# EAGLE design Snowman (EAGLE 6.5.0)
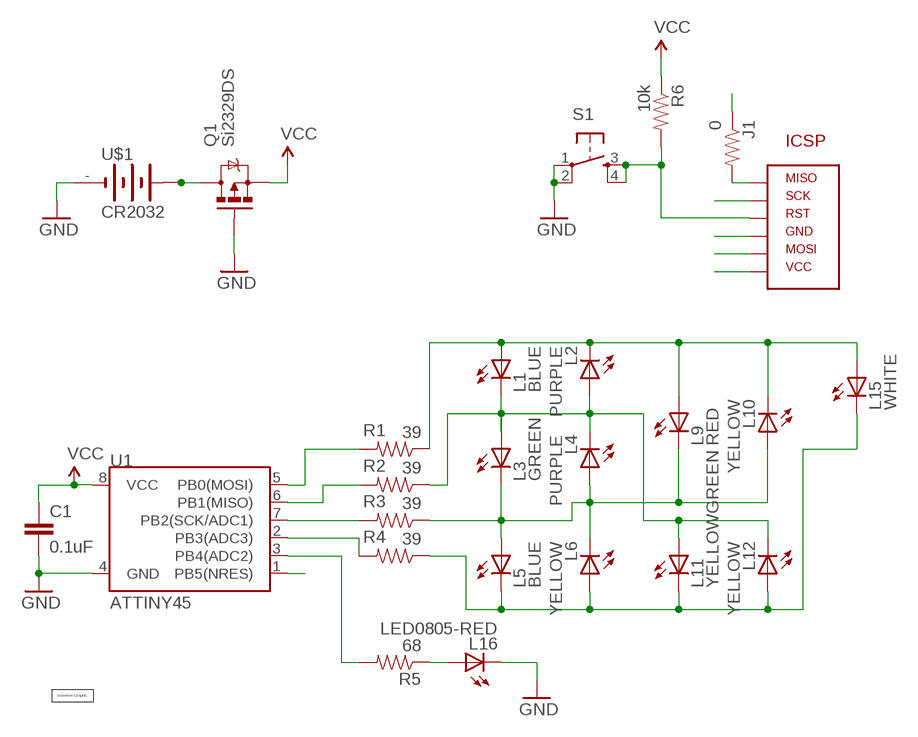
[diagram p0: schematic, sheet 1]

## Parts
C1  0.1uF  CAP0805  [0805]
J1  0  RESISTOR0805-RES  [0805]
L1  BLUE  LED0805-RED  [LED-0805-RED]
L2  PURPLE  LED0805-GREEN  [LED-0805-GREEN]
L3  GREEN  LED0805-RED  [LED-0805-RED]
L4  PURPLE  LED0805-GREEN  [LED-0805-GREEN]
L5  BLUE  LED0805-RED  [LED-0805-RED]
L6  YELLOW  LED0805-GREEN  [LED-0805-GREEN]
L9  RED  LED0805-RED  [LED-0805-RED]
L10  YELLOW  LED0805-GREEN  [LED-0805-GREEN]
L11  YELLOWGREEN  LED0805-GREEN  [LED-0805-GREEN]
L12  YELLOW  LED0805-RED  [LED-0805-RED]
L15  WHITE  LED0805-RED  [LED-0805-RED]
L16  LED0805-RED  [LED-0805-RED]
Q1  Si2329DS  MOSFET_P_CH  [SOT23-3]
R1  39  RESISTOR0805-RES  [0805]
R2  39  RESISTOR0805-RES  [0805]
R3  39  RESISTOR0805-RES  [0805]
R4  39  RESISTOR0805-RES  [0805]
R5  68  RESISTOR0805-RES  [0805]
R6  10k  RESISTOR0805-RES  [0805]
S1  TAC_SWITCHSMD  [TACTILE_SWITCH_SMD]
U1  ATTINY45  [SO08-EIAJ]
U$1  CR2032  BAT-HLD-001  [BAT-HLD-001]
U$2  5X6_SNOWMAN5X5  [5X5_SNOWMAN]
U$3  AVR_ICSP_6P6PIN  [AVR_ICSP_6P_SMD]

## Nets
GND: C1.2 L16.C Q1.1(G) S1.1 S1.2 U1.4(GND) U$1.- U$3.GND
L12: L1.C L2.A L3.A L4.C L11.A L12.C R2.1
MISO: J1.1 R2.2 U1.6(PB1(MISO))
MOSI: R1.2 U1.5(PB0(MOSI)) U$3.MOSI
N$1: Q1.3(D) U$1.+@1(+) U$1.+@2(+)
N$2: R5.2 U1.3(PB4(ADC2))
N$3: L3.C L4.A L5.A L6.C L9.C L10.A R3.1
N$4: R4.2 U1.2(PB3(ADC3))
N$5: L5.C L6.A L11.C L12.A L15.C R4.1
N$6: L1.A L2.C L9.A L10.C L15.A R1.1
N$7: L16.A R5.1
N$8: J1.2 U$3.MISO
RST: R6.2 S1.3 S1.4 U1.1(PB5(NRES)) U$3.RST
SCK: R3.2 U1.7(PB2(SCK/ADC1)) U$3.SCK
VCC: C1.1 Q1.2(S) R6.1 U1.8(VCC) U$3.VCC

## Notes on the sheet
- ICSP

## Library data of the parts
C1 = SparkFun-Capacitors:CAP: Capacitor Standard 0603 ceramic capacitor, and 0.1" leaded capacitor.
J1 = SparkFun-Passives:RESISTOR: Resistor Basic schematic elements and footprints for 0603, 1206, and PTH resistors.
L1-L6 L9-L12 L15 L16 = My Custom Parts:LED
Q1 = My Custom Parts:MOSFET_P_CH
R1-R6 = SparkFun-Resistors:RESISTOR: Resistor Basic schematic elements and footprints for 0603, 1206, and PTH resistors.
S1 = My Custom Parts:TAC_SWITCH: Momentary Switch Button commonly used for reset or general input. Spark Fun Electronics SKU : COM-00097 SMT- SWCH-08247; PROD_ID: SWCH-08247
U1 = SparkFun:ATTINY45: Atmel ATTiny45
U$1 = My Custom Parts:BAT-HLD-001
U$2 = BMPs:5X6_SNOWMAN: 5cm X 6cm Snowman Graphic
U$3 = My Custom Parts:AVR_ICSP_6P

## Board
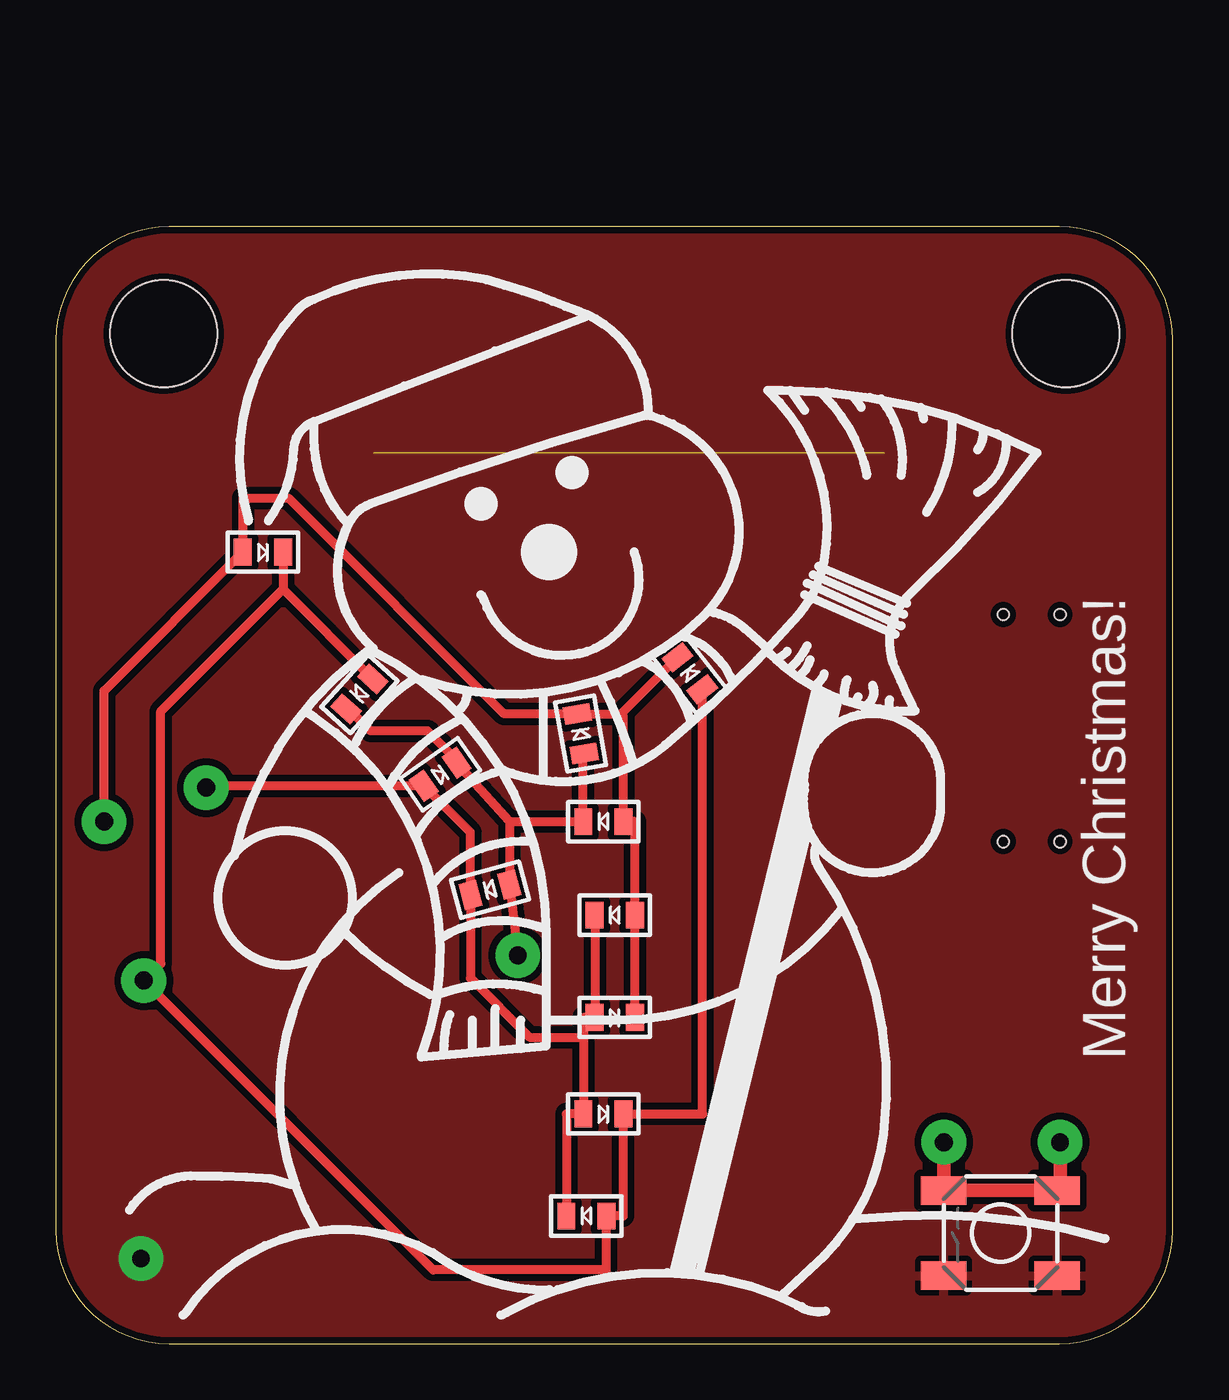
[diagram p1: board, top side]
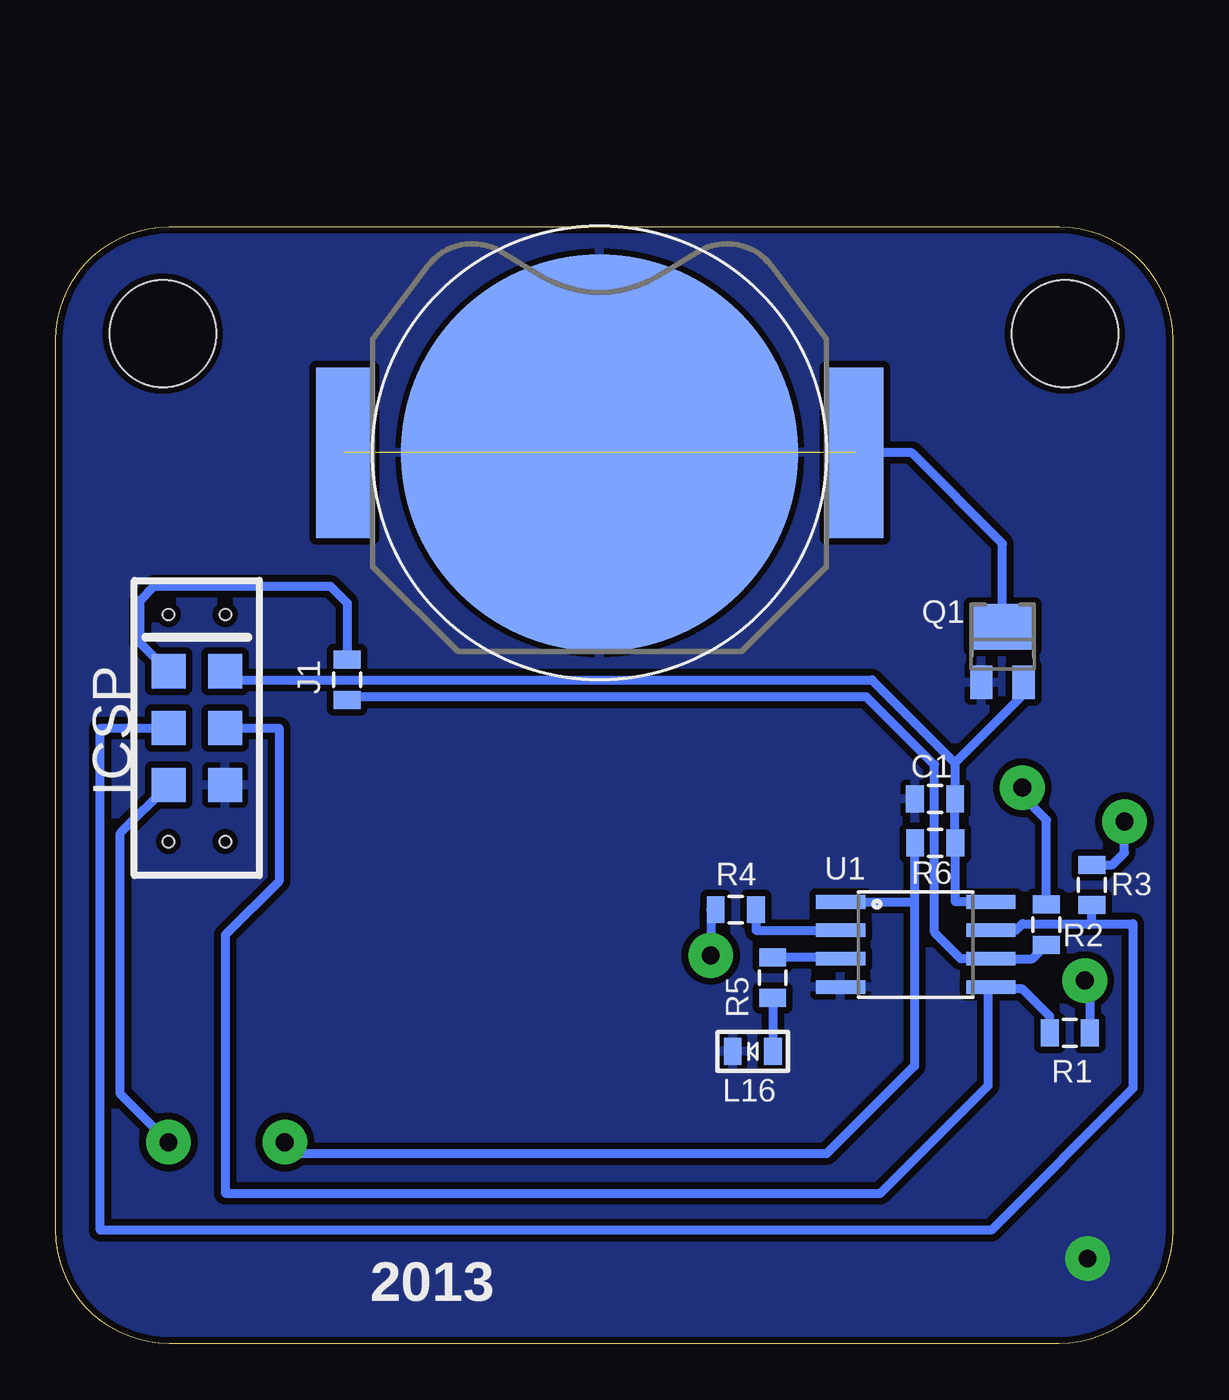
[diagram p2: board, bottom side, seen from below]

Size 50 x 50 mm. Coordinates in mm from the lower left corner, seen from the top.
Outline: 0,44.92 0,5.08 arc90 5.08,0 44.92,0 arc90 50,5.08 50,44.92 arc90 44.92,50 5.08,50 arc90 0,44.92
Copper layers (1*16): Top 0.035mm / dielectric 1.5mm / Bottom 0.035mm
Design rules "tim": minimum track width 10mil, minimum drill 32mil, track to track 12mil, track to pad 12mil, pad to pad 12mil, via to via 12mil, smd to smd 8mil, copper to edge 12mil, drill to drill 12mil, minimum pad ring 0.6mm, minimum via ring 0.6mm, stop-mask expansion 0mil, vias tented up to drill 0mil, thermal gap 10mil
Holes 4.76 mm at 4.83,45.21 45.21,45.21

### Footprints (pad centres in the part's own frame; a part is rotated, then mirrored left to right if it is on the bottom)
0805 = smd 0.8 x 1.2: 1 -0.9,0; 2 0.9,0
LED-0805-RED = smd 0.8 x 1.2: A -0.9,0; C 0.9,0
LED-0805-GREEN = smd 0.8 x 1.2: A -0.9,0; C 0.9,0
SOT23-3 = smd 1 x 1.5: 1 -0.95,-1.254; 2 0.95,-1.254 | smd 2.9 x 2.05: 3 0,1.227
TACTILE_SWITCH_SMD = smd 2.032 x 1.27: 1 -2.54,1.905; 2 2.54,1.905; 3 -2.54,-1.905; 4 2.54,-1.905
SO08-EIAJ = smd 0.61 x 2.21: 1 -1.905,-3.378; 2 -0.635,-3.378; 3 0.635,-3.378; 4 1.905,-3.378; 5 1.905,3.353; 6 0.635,3.353; 7 -0.635,3.353; 8 -1.905,3.353
BAT-HLD-001 = smd 2.54 x 7.62: +@1 -11.43,0; +@2 11.43,0 | smd 17.78 x 17.78: - 0,0
AVR_ICSP_6P_SMD = smd 1.524 x 1.524: GND 0,0; MISO 5.08,2.54; MOSI 2.54,0; RST 0,2.54; SCK 2.54,2.54; VCC 5.08,0 | hole 0.5: -2.54,2.54; 7.62,2.54; -2.54,0; 7.62,0

### Placement (x,y rotation side)
C1  10.64,24.38 180 bottom
J1  36.96,29.72 90 bottom
L1  23.75,5.71 180 top
L2  24.51,10.29 0 top
L3  25.02,14.61 0 top
L4  25.02,19.18 180 top
L5  24.51,23.37 180 top
L6  23.5,27.3 100 top
L9  28.38,30.01 128 top
L10  9.27,35.43 0 top
L11  17.21,25.49 35 top
L12  19.43,20.32 195 top
L15  13.59,29.08 228 top
L16  18.8,13.08 180 bottom
Q1  7.62,30.86 0 bottom
R1  4.61,13.91 180 bottom
R2  5.65,18.76 270 bottom
R3  3.62,20.54 270 bottom
R4  19.56,19.43 0 bottom
R5  17.91,16.38 90 bottom
R6  10.63,22.42 180 bottom
S1  42.29,4.95 180 top
U1  11.5,17.87 270 bottom
U$1  25.65,39.88 180 bottom
U$2  -0.08,-0.7 0 top
U$3  42.42,25.02 90 bottom

### Tracks (layer width: path | path; a pad name or v marks a point on that pad's centre or on a via)
GND  (via drill 0.8)
  other vias: 3.81,3.81
  pour Top (isolate 0.305): -1.14,50.93 -1.14,-1.14 52.32,-1.14 52.32,50.93
  pour Bottom (isolate 0.305): -1.91,51.69 52.07,51.56 51.82,-1.14 -2.16,-1.02
L12  (via drill 0.8)
  Top 0.406: 23.62,13.72 23.62,14.61 L3.A L4.C | 23.62,13.72 23.62,10.29 L2.A 22.86,10.29 L1.C | 23.62,13.72 21.21,13.72 18.56,16.36 L12.C 18.56,22.89 L11.A 6.81,24.97 v6.73,24.89
  Bottom 0.406: v6.73,24.89 6.73,24.51 5.65,23.43 R2.1
MISO
  Bottom 0.406: 5.71,17.8 R2.2 6.28,17.23 U1.6 9.49,17.23 10.67,18.41 10.67,25.91 13.72,28.96 36.82,28.96 J1.1
MOSI
  Bottom 0.406: U$3.MOSI 40.01,27.56 40.01,20.7 42.42,18.29 42.42,6.73 13.08,6.73 8.26,11.56 8.26,15.85 U1.5 8.05,15.88 6.73,15.88 5.51,14.65 R1.2
N$1  (1 unrouted)
  Bottom 0.406: U$1.+@1 11.68,39.88 7.62,35.81 Q1.3
N$2
  Bottom 0.406: U1.3 14.87,17.28 R5.2
N$3  (via drill 0.8)
  Top 0.406: L3.C L4.A 25.92,23.37 L5.A 25.41,28.08 25.3,28.19 | 25.3,28.19 L6.C 20.07,28.19 10.41,37.85 8.38,37.85 8.38,35.43 L10.A 2.16,29.22 v2.16,23.37 | 25.3,28.19 L9.C
  Bottom 0.406: R3.1 2.69,21.44 2.16,21.97 v2.16,23.37
N$4
  Bottom 0.406: U1.2 18.66,18.5 R4.2
N$5  (via drill 0.8)
  Top 0.305: 23.61,26.16 L6.A
  Top 0.406: 20.3,23.37 L5.C 23.61,26.16 | 20.3,23.37 L12.A v20.68,17.38 | L15.C 13.12,28.41 14.1,27.43 16.64,27.43 17.95,26.12 L11.C 20.3,23.37
  Bottom 0.406: R4.1 20.68,19.43 v20.68,17.38
N$6  (via drill 0.8)
  Top 0.406: L9.A 28.96,29.28 28.96,10.29 L2.C 25.4,5.71 L1.A 24.64,5.71 24.64,3.3 16.89,3.3 v3.94,16.26 4.7,17.02 4.7,28.3 10.17,33.77 | L10.C 10.17,33.77 | 10.17,33.77 L15.A
  Bottom 0.406: v3.94,16.26 3.71,16.03 R1.1
N$7
  Bottom 0.406: R5.1 L16.A
N$8
  Bottom 0.406: J1.2 36.96,33.15 37.72,33.91 45.59,33.91 46.23,33.27 46.23,31.37 U$3.MISO
N$10
  pour Top (isolate 0.254): 5.08,38.1 33.02,38.1 33.02,2.54 5.08,2.54
RST  (via drill 0.8, 0.8 pad 1.27)
  Top 0.305: S1.3 44.96,6.86
  Top 0.61: v39.75,9.02 S1.4 S1.3 | 44.96,6.86 v44.96,9.02
  Bottom 0.305: v39.75,9.01 v39.75,9.02
  Bottom 0.406: R6.2 11.56,22.39 11.56,19.81 | v39.75,9.02 39.75,8.5 15.49,8.5 11.56,12.44 11.56,19.81 | U1.1 11.6,19.77 11.56,19.81 | v44.96,9.02 47.12,11.18 47.12,22.86 U$3.RST
SCK
  Bottom 0.406: 3.62,18.8 6.73,18.8 7.02,18.5 U1.7 | 3.62,18.8 R3.2 | U$3.SCK 48.01,27.56 48.01,5.08 8.13,5.08 1.78,11.43 1.78,18.8 3.62,18.8
VCC
  Bottom 0.406: U$3.VCC 42.04,29.72 13.46,29.72 9.74,26 | 9.74,26 C1.1 9.74,22.42 R6.1 9.73,19.77 U1.8 | Q1.2 6.67,29.07 9.74,26

### Text on the board
tPlace: Merry Christmas!
bPlace: 2013
bNames: ICSP